# EAGLE schematic sensor (EAGLE 7.2.0)
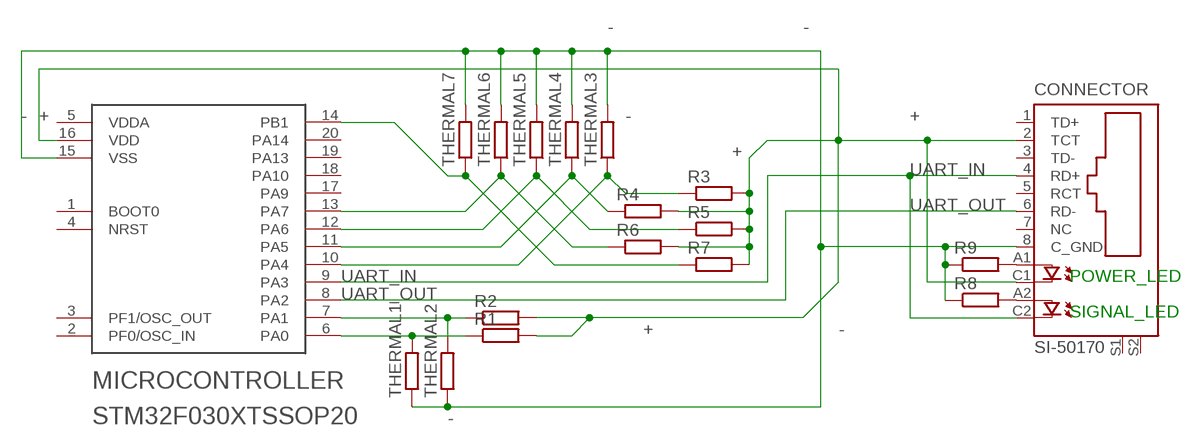
[diagram p0: schematic, sheet 1]

## Parts
CONNECTOR  SI-50170  [SI-50170]
MICROCONTROLLER  STM32F030XTSSOP20  [TSSOP-20]
R1  R-EU_0204/5  [0204/5]
R2  R-EU_0204/5  [0204/5]
R3  R-EU_0204/5  [0204/5]
R4  R-EU_0204/5  [0204/5]
R5  R-EU_0204/5  [0204/5]
R6  R-EU_0204/5  [0204/5]
R7  R-EU_0204/5  [0204/5]
R8  R-EU_0204/5  [0204/5]
R9  R-EU_0204/5  [0204/5]
THERMAL1  R-EU_V526-0  [V526-0]
THERMAL2  R-EU_V526-0  [V526-0]
THERMAL3  R-EU_V526-0  [V526-0]
THERMAL4  R-EU_V526-0  [V526-0]
THERMAL5  R-EU_V526-0  [V526-0]
THERMAL6  R-EU_V526-0  [V526-0]
THERMAL7  R-EU_V526-0  [V526-0]

## Nets
+: CONNECTOR.2(TCT) CONNECTOR.C1(C) MICROCONTROLLER.16(VDD) R1.2 R2.2 R3.2 R4.2 R5.2 R6.2 R7.2
-: CONNECTOR.8(C_GND) MICROCONTROLLER.15(VSS) R8.1 R9.1 THERMAL1.1 THERMAL2.1 THERMAL3.2 THERMAL4.2 THERMAL5.2 THERMAL6.2 THERMAL7.2
N$1: MICROCONTROLLER.10(PA4) R3.1 THERMAL3.1
N$2: CONNECTOR.A2(A1) R8.2
N$3: MICROCONTROLLER.11(PA5) R4.1 THERMAL4.1
N$4: CONNECTOR.A1(A) R9.2
N$5: MICROCONTROLLER.6(PA0) R1.1 THERMAL1.2
N$6: MICROCONTROLLER.7(PA1) R2.1 THERMAL2.2
N$7: MICROCONTROLLER.12(PA6) R5.1 THERMAL5.1
N$8: MICROCONTROLLER.13(PA7) R6.1 THERMAL6.1
N$9: MICROCONTROLLER.14(PB1) R7.1 THERMAL7.1
UART_IN: CONNECTOR.4(RD+) CONNECTOR.C2(C1) MICROCONTROLLER.9(PA3)
UART_OUT: CONNECTOR.6(RD-) MICROCONTROLLER.8(PA2)
Unconnected: CONNECTOR.1(TD+) CONNECTOR.3(TD-) CONNECTOR.5(RCT) CONNECTOR.7(NC) CONNECTOR.S1 CONNECTOR.S2 MICROCONTROLLER.1(BOOT0) MICROCONTROLLER.2(PF0/OSC_IN) MICROCONTROLLER.3(PF1/OSC_OUT) MICROCONTROLLER.4(NRST) MICROCONTROLLER.5(VDDA) MICROCONTROLLER.17(PA9) MICROCONTROLLER.18(PA10) MICROCONTROLLER.19(PA13) MICROCONTROLLER.20(PA14)

## Notes on the sheet
- POWER_LED
- SIGNAL_LED

## Library data of the parts
CONNECTOR = con-stewart:SI-50170: Ethernet Connector MagJack (R) Source: www.stewartconnector.com .. si-50170.pdf; OC_FARNELL: unknown; OC_NEWARK: unknown
MICROCONTROLLER = stm32f030x:STM32F030X
R1-R9 THERMAL1-THERMAL7 = resistor:R-EU_: RESISTOR, European symbol